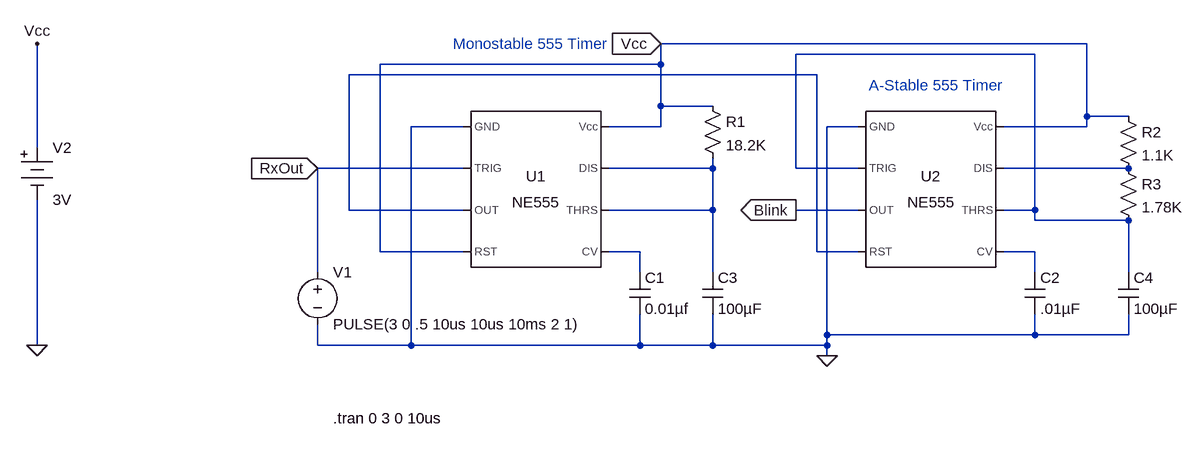
[diagram p0: schematic 555TimerPlan.asc]
555TimerPlan.asc, the LTspice schematic file:
Version 4
SHEET 1 1336 680
WIRE 1184 64 528 64
WIRE 1104 80 736 80
WIRE 528 96 528 64
WIRE 528 96 96 96
WIRE 768 112 48 112
WIRE 528 160 528 96
WIRE 608 160 528 160
WIRE 1184 176 1184 64
WIRE 1248 176 1184 176
WIRE 224 192 144 192
WIRE 528 192 528 160
WIRE 528 192 448 192
WIRE 832 192 784 192
WIRE 1184 192 1184 176
WIRE 1184 192 1056 192
WIRE -432 224 -432 64
WIRE 224 256 0 256
WIRE 608 256 608 240
WIRE 608 256 448 256
WIRE 736 256 736 80
WIRE 832 256 736 256
WIRE 1248 256 1056 256
WIRE 48 320 48 112
WIRE 224 320 48 320
WIRE 608 320 608 256
WIRE 608 320 448 320
WIRE 832 320 736 320
WIRE 1104 320 1104 80
WIRE 1104 320 1056 320
WIRE 1104 336 1104 320
WIRE 1248 336 1104 336
WIRE 96 384 96 96
WIRE 224 384 96 384
WIRE 496 384 448 384
WIRE 768 384 768 112
WIRE 832 384 768 384
WIRE 1104 384 1056 384
WIRE 0 416 0 256
WIRE 496 416 496 384
WIRE 608 416 608 320
WIRE 1104 416 1104 384
WIRE 1248 416 1248 336
WIRE 784 512 784 192
WIRE 1104 512 1104 480
WIRE 1104 512 784 512
WIRE 1248 512 1248 480
WIRE 1248 512 1104 512
WIRE -432 528 -432 304
WIRE 0 528 0 496
WIRE 144 528 144 192
WIRE 144 528 0 528
WIRE 496 528 496 480
WIRE 496 528 144 528
WIRE 608 528 608 480
WIRE 608 528 496 528
WIRE 784 528 784 512
WIRE 784 528 608 528
WIRE 784 544 784 528
FLAG 528 64 Vcc
IOPIN 528 64 In
FLAG 784 544 0
FLAG 0 256 RxOut
IOPIN 0 256 In
FLAG -432 528 0
FLAG -432 64 Vcc
FLAG 736 320 Blink
IOPIN 736 320 Out
SYMBOL Misc/NE555 336 288 R0
SYMATTR InstName U1
SYMBOL Misc/NE555 944 288 R0
SYMATTR InstName U2
SYMBOL cap 480 416 R0
SYMATTR InstName C1
SYMATTR Value 0.01µf
SYMBOL cap 1088 416 R0
SYMATTR InstName C2
SYMATTR Value .01µF
SYMBOL cap 592 416 R0
SYMATTR InstName C3
SYMATTR Value 100µF
SYMBOL res 592 144 R0
SYMATTR InstName R1
SYMATTR Value 18.2K
SYMBOL res 1232 160 R0
SYMATTR InstName R2
SYMATTR Value 1.1K
SYMBOL res 1232 240 R0
SYMATTR InstName R3
SYMATTR Value 1.78K
SYMBOL cap 1232 416 R0
SYMATTR InstName C4
SYMATTR Value 100µF
SYMBOL voltage 0 400 R0
SYMATTR InstName V1
SYMATTR Value PULSE(3 0 .5 10us 10us 10ms 2 1)
SYMBOL Misc/battery -432 208 R0
SYMATTR InstName V2
SYMATTR Value 3V
TEXT 208 64 Left 2 ;Monostable 555 Timer
TEXT 848 128 Left 2 ;A-Stable 555 Timer
TEXT 24 640 Left 2 !.tran 0 3 0 10us

The netlist it stands for:
* 555TimerPlan.asc
XU1 0 RxOut N002 Vcc N005 N003 N003 Vcc NE555  ; pins GND TRIG OUT RST CV THRS DIS Vcc
XU2 0 N001 Blink N002 N006 N001 N004 Vcc NE555  ; pins GND TRIG OUT RST CV THRS DIS Vcc
C1 N005 0 0.01µf
C2 N006 0 .01µF
C3 N003 0 100µF
R1 Vcc N003 18.2K
R2 Vcc N004 1.1K
R3 N004 N001 1.78K
C4 N001 0 100µF
V1 RxOut 0 PULSE(3 0 .5 10us 10us 10ms 2 1)
V2 Vcc 0 3V
* Monostable 555 Timer
* A-Stable 555 Timer
.tran 0 3 0 10us
.lib NE555.sub
.backanno
.end